# Altium project Seadream-Avionics-V2.PrjPcb
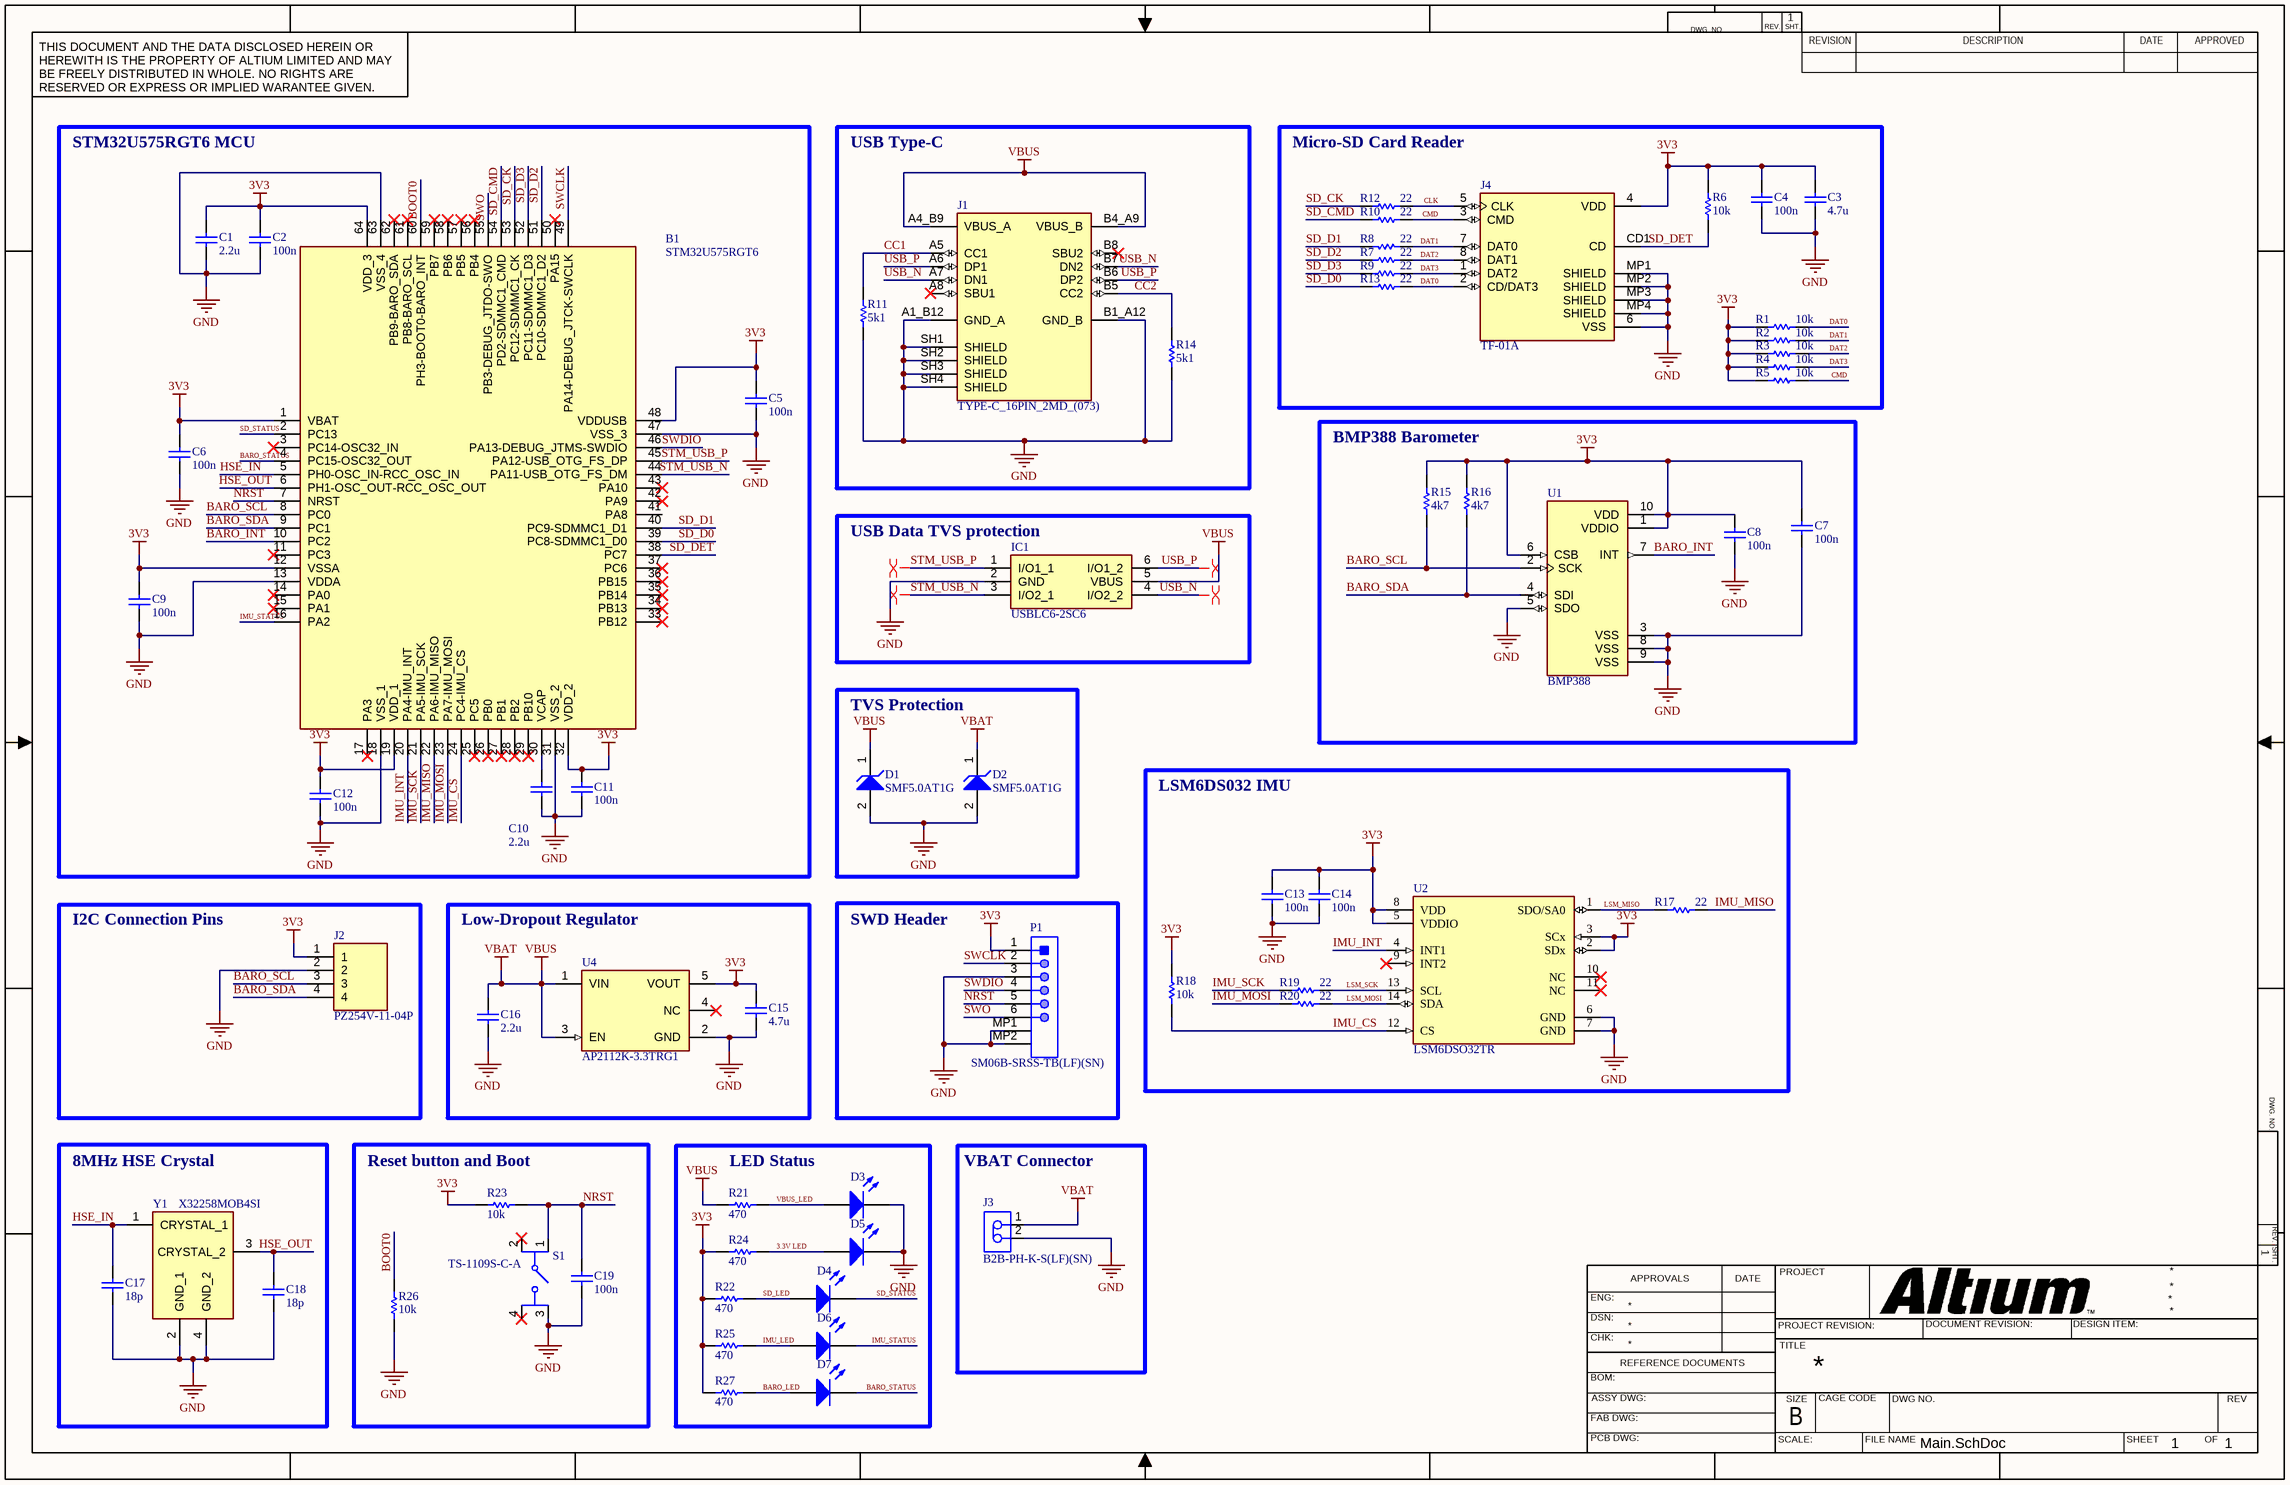
[diagram p0: Main.SchDoc]
1 sheet, 65 parts. Net scope: global (net labels, ports and power ports of the same name join across sheets).
Board file: Seadream_PCB.PcbDoc

## Sheet Main.SchDoc
size 431 x 279 mm; SheetNumber: 1; SheetTotal: 1

### Parts
B1  STM32U575RGT6  [QFP50P1200X1200X160-64N]
C1  value 2.2u  [CAPC1608X90X40LL10T20]  (hidden comment: Capacitor)
C2  value 100n  [CAPC0402(1005)60_L]  (hidden comment: Capacitor)
C3  value 4.7u  [CAPC1608X90X40LL10T20]  (hidden comment: Capacitor)
C4  value 100n  [CAPC0402(1005)60_L]  (hidden comment: Capacitor)
C5  value 100n  [CAPC0402(1005)60_L]  (hidden comment: Capacitor)
C6  value 100n  [CAPC0402(1005)60_L]  (hidden comment: Capacitor)
C7  value 100n  [CAPC0402(1005)60_L]  (hidden comment: Capacitor)
C8  value 100n  [CAPC0402(1005)60_L]  (hidden comment: Capacitor)
C9  value 100n  [CAPC0402(1005)60_L]  (hidden comment: Capacitor)
C10  value 2.2u  [CAPC1608X90X40LL10T20]  (hidden comment: Capacitor)
C11  value 100n  [CAPC0402(1005)60_L]  (hidden comment: Capacitor)
C12  value 100n  [CAPC0402(1005)60_L]  (hidden comment: Capacitor)
C13  value 100n  [CAPC0402(1005)60_L]  (hidden comment: Capacitor)
C14  value 100n  [CAPC0402(1005)60_L]  (hidden comment: Capacitor)
C15  value 4.7u  [CAPC1608X90X40LL10T20]  (hidden comment: Capacitor)
C16  value 2.2u  [CAPC1608X90X40LL10T20]  (hidden comment: Capacitor)
C17  value 18p  [CAPC0402(1005)60_L]  (hidden comment: Capacitor)
C18  value 18p  [CAPC0402(1005)60_L]  (hidden comment: Capacitor)
C19  value 100n  [CAPC0402(1005)60_L]  (hidden comment: Capacitor)
D1  SMF5.0AT1G  [ONSC-SOD-123FL-2-498_V]
D2  SMF5.0AT1G  [ONSC-SOD-123FL-2-498_V]
D3  Light-Emitting Diode  [LTST-C191KRKT_V]  (value not drawn)
D4  Light-Emitting Diode  [LTST-C191KRKT_V]  (value not drawn)
D5  Light-Emitting Diode  [LTST-C191KRKT_V]  (value not drawn)
D6  Light-Emitting Diode  [LTST-C191KRKT_V]  (value not drawn)
D7  Light-Emitting Diode  [LTST-C191KRKT_V]  (value not drawn)
IC1  USBLC6-2SC6  [SOT95P280X145-6N]
J1  TYPE-C_16PIN_2MD_(073)  [SHOUHAN_TYPE-C_16PIN_2MD_(073)]
J2  PZ254V-11-04P  [HDRV4W64P0X254_1X4_1016X250X890P]
J3  B2B-PH-K-S(LF)(SN)  [JST-B2B-PH-K-S_V]
J4  TF-01A  [TF-01A]
P1  SM06B-SRSS-TB(LF)(SN)  [JST-SM06B-SRSS-TB_V]
R1  value 10k  [RESC0402(1005)_L]  (hidden comment: Resistor)
R2  value 10k  [RESC0402(1005)_L]  (hidden comment: Resistor)
R3  value 10k  [RESC0402(1005)_L]  (hidden comment: Resistor)
R4  value 10k  [RESC0402(1005)_L]  (hidden comment: Resistor)
R5  value 10k  [RESC0402(1005)_L]  (hidden comment: Resistor)
R6  value 10k  [RESC0402(1005)_L]  (hidden comment: Resistor)
R7  value 22  [RESC0402(1005)_L]  (hidden comment: Resistor)
R8  value 22  [RESC0402(1005)_L]  (hidden comment: Resistor)
R9  value 22  [RESC0402(1005)_L]  (hidden comment: Resistor)
R10  value 22  [RESC0402(1005)_L]  (hidden comment: Resistor)
R11  value 5k1  [RESC0402(1005)_L]  (hidden comment: Resistor)
R12  value 22  [RESC0402(1005)_L]  (hidden comment: Resistor)
R13  value 22  [RESC0402(1005)_L]  (hidden comment: Resistor)
R14  value 5k1  [RESC0402(1005)_L]  (hidden comment: Resistor)
R15  value 4k7  [RESC0402(1005)_L]  (hidden comment: Resistor)
R16  value 4k7  [RESC0402(1005)_L]  (hidden comment: Resistor)
R17  value 22  [RESC0402(1005)_L]  (hidden comment: Resistor)
R18  value 10k  [RESC0402(1005)_L]  (hidden comment: Resistor)
R19  value 22  [RESC0402(1005)_L]  (hidden comment: Resistor)
R20  value 22  [RESC0402(1005)_L]  (hidden comment: Resistor)
R21  value 470  [RESC1608X55X25LL10T15]  (hidden comment: Resistor)
R22  value 470  [RESC1608X55X25LL10T15]  (hidden comment: Resistor)
R23  value 10k  [RESC0402(1005)_L]  (hidden comment: Resistor)
R24  value 470  [RESC1608X55X25LL10T15]  (hidden comment: Resistor)
R25  value 470  [RESC1608X55X25LL10T15]  (hidden comment: Resistor)
R26  value 10k  [RESC0402(1005)_L]  (hidden comment: Resistor)
R27  value 470  [RESC1608X55X25LL10T15]  (hidden comment: Resistor)
S1  TS-1109S-C-A  [TS1109SCA]
U1  BMP388  [PQFN50P200X200X80-10N]
U2  LSM6DSO32TR  [FP-LGA-14L-DM00249496-MFG]
U4  AP2112K-3.3TRG1  [FP-SOT25-IPC_C]
Y1  X32258MOB4SI  [X32258MOB4SI]

### Blocks framed on the sheet
STM32U575RGT6 MCU: B1 C1 C2 C5 C6 C9-C12
USB Type-C: J1 R11 R14
Micro-SD Card Reader: C3 C4 J4 R1-R10 R12 R13
BMP388 Barometer: C7 C8 R15 R16 U1
USB Data TVS protection: IC1
TVS Protection: D1 D2
LSM6DS032 IMU: C13 C14 R17-R20 U2
I2C Connection Pins: J2
Low-Dropout Regulator: C15 C16 U4
SWD Header: P1
8MHz HSE Crystal: C17 C18 Y1
Reset button and Boot: C19 R23 R26 S1
LED Status: D3-D7 R21 R22 R24 R25 R27
VBAT Connector: J3

### Nets
3V3: B1.1(VBAT) B1.12(VSSA) B1.19(VDD_1) B1.32(VDD_2) B1.48(VDDUSB) B1.64(VDD_3) C1.2 C2.2 C3.2 C4.2 C5.2 C6.2 C7.2 C8.2 C9.2 C11.2 C12.2 C13.2 C14.2 C15.2 J2.1 J4.4(VDD) P1.1 R1.1 R2.1 R3.1 R4.1 R5.1 R6.2 R15.2 R16.2 R18.2 R22.1 R23.2 R24.1 R25.1 R27.1 U1.1(VDDIO) U1.6(CSB) U1.10(VDD) U2.2(SDx) U2.3(SCx) U2.5(VDDIO) U2.8(VDD) U4.5(VOUT)
GND: B1.13(VDDA) B1.18(VSS_1) B1.31(VSS_2) B1.47(VSS_3) B1.63(VSS_4) C1.1 C2.1 C3.1 C4.1 C5.1 C6.1 C7.1 C8.1 C9.1 C10.1 C11.1 C12.1 C13.1 C14.1 C15.1 C16.1 C17.1 C18.1 C19.1 D1.2(A) D2.2(A) D3.2(K) D5.2(K) IC1.2(GND) J1.A1_B12(GND_A) J1.B1_A12(GND_B) J1.SH1(SHIELD) J1.SH2(SHIELD) J1.SH3(SHIELD) J1.SH4(SHIELD) J2.2 J3.2 J4.6(VSS) J4.MP1(SHIELD) J4.MP2(SHIELD) J4.MP3(SHIELD) J4.MP4(SHIELD) P1.3 P1.MP1 P1.MP2 R11.1 R14.1 R26.1 S1.3(NO_1) U1.3(VSS) U1.5(SDO) U1.8(VSS) U1.9(VSS) U2.6(GND) U2.7(GND) U4.2(GND) Y1.2(GND_1) Y1.4(GND_2)
VBAT: C16.2 D1.1(K) D2.1(K) IC1.5(VBUS) J1.A4_B9(VBUS_A) J1.B4_A9(VBUS_B) J3.1 R21.1 U4.1(VIN) U4.3(EN)  [also labelled VBUS]
3.3V LED: D5.1(A) R24.2
BARO_INT: B1.10(PC2) U1.7(INT)
BARO_LED: D7.1(A) R27.2
BARO_SCL: B1.8(PC0) J2.3 R15.1 U1.2(SCK)
BARO_SDA: B1.9(PC1) J2.4 R16.1 U1.4(SDI)
BARO_STATUS: B1.4(PC15-OSC32_OUT) D7.2(K)
BOOT0: B1.60(PH3-BOOT0-BARO_INT) R26.2
CC1: J1.A5(CC1) R11.2
CC2: J1.B5(CC2) R14.2
CLK: J4.5(CLK) R12.1
CMD: J4.3(CMD) R5.2 R10.1
DAT0: J4.2(CD/DAT3) R1.2 R13.1
DAT1: J4.7(DAT0) R2.2 R8.2
DAT2: J4.8(DAT1) R3.2 R7.1
DAT3: J4.1(DAT2) R4.2 R9.1
HSE_IN: B1.5(PH0-OSC_IN-RCC_OSC_IN) C17.2 Y1.1(CRYSTAL_1)
HSE_OUT: B1.6(PH1-OSC_OUT-RCC_OSC_OUT) C18.2 Y1.3(CRYSTAL_2)
IMU_CS: B1.24(PC4-IMU_CS) R18.1 U2.12(CS)
IMU_INT: B1.20(PA4-IMU_INT) U2.4(INT1)
IMU_LED: D6.1(A) R25.2
IMU_MISO: B1.22(PA6-IMU_MISO) R17.1
IMU_MOSI: B1.23(PA7-IMU_MOSI) R20.2
IMU_SCK: B1.21(PA5-IMU_SCK) R19.2
IMU_STATUS: B1.16(PA2) D6.2(K)
LSM_MISO: R17.2 U2.1(SDO/SA0)
LSM_MOSI: R20.1 U2.14(SDA)
LSM_SCK: R19.1 U2.13(SCL)
NRST: B1.7(NRST) C19.2 P1.5 R23.1 S1.1(COM_1)
SD_CK: B1.53(PC12-SDMMC1_CK) R12.2
SD_CMD: B1.54(PD2-SDMMC1_CMD) R10.2
SD_D0: B1.39(PC8-SDMMC1_D0) R13.2
SD_D1: B1.40(PC9-SDMMC1_D1) R8.1
SD_D2: B1.51(PC10-SDMMC1_D2) R7.2
SD_D3: B1.52(PC11-SDMMC1_D3) R9.2
SD_DET: B1.38(PC7) J4.CD1(CD) R6.1
SD_LED: D4.1(A) R22.2
SD_STATUS: B1.2(PC13) D4.2(K)
STM_USB_N: B1.44(PA11-USB_OTG_FS_DM) IC1.3(I/O2_1)
STM_USB_P: B1.45(PA12-USB_OTG_FS_DP) IC1.1(I/O1_1)
SWCLK: B1.49(PA14-DEBUG_JTCK-SWCLK) P1.2
SWDIO: B1.46(PA13-DEBUG_JTMS-SWDIO) P1.4
SWO: B1.55(PB3-DEBUG_JTDO-SWO) P1.6
USB_N: IC1.4(I/O2_2) J1.A7(DN1) J1.B7(DN2)
USB_P: IC1.6(I/O1_2) J1.A6(DP1) J1.B6(DP2)
VBUS_LED: D3.1(A) R21.2
NetB1_30: B1.30(VCAP) C10.2

Not connected (* = marked no-connect by the designer): B1 3(PC14-OSC32_IN)* 11(PC3)* 14(PA0)* 15(PA1)* 17(PA3)* 25(PC5)* 26(PB0)* 27(PB1)* 28(PB2)* 29(PB10)* 33(PB12)* 34(PB13)* 35(PB14)* 36(PB15)* 37(PC6)* 41(PA8) 42(PA9)* 43(PA10)* 50(PA15)* 56(PB4)* 57(PB5)* 58(PB6)* 59(PB7)* 61(PB8-BARO_SCL)* 62(PB9-BARO_SDA)*; J1 A8(SBU1)* B8(SBU2)*; S1 2(COM_2)* 4(NO_2)*; U2 9(INT2)* 10(NC)* 11(NC)*; U4 4(NC)*

### Layout directives
differential pair: STM_USB_N, STM_USB_P, USB_N, USB_P

### Notes on the sheet
- DWG. NO.
- REV.
- SHT.
- THIS DOCUMENT AND THE DATA DISCLOSED HEREIN OR HEREWITH IS THE PROPERTY OF ALTIUM LIMITED AND MAY BE FREELY DISTRIBUTED IN WHOLE. NO RIGHTS ARE RESERVED OR EXPRESS OR IMPLIED WARANTEE GIVEN.
- REVISION
- DESCRIPTION
- DATE
- APPROVED
- ENG:
- APPROVALS
- PROJECT
- DSN:
- CHK:
- REFERENCE DOCUMENTS
- PROJECT REVISION:
- TITLE
- DOCUMENT REVISION:
- DESIGN ITEM:
- BOM:
- FAB DWG:
- PCB DWG:
- ASSY DWG:
- SCALE:
- SIZE
- B
- CAGE CODE
- FILE NAME
- DWG NO.
- SHEET
- OF
- REV

### Library data of the parts
B1 = STM32U575RGT6: Ultra-low-power Arm Cortex-M33 32-bit MCU+TrustZone+FPU, 240 DMIPS, up to 2 MB Flash memory, 786 KB SRAM; Manufacturer_Name: STMicroelectronics; Geometry.Height: 1.6mm; Manufacturer_Part_Number: STM32U575RGT6; Datasheet Link: https://www.st.com/resource/en/datasheet/stm32u575ag.pdf
C1 C10 C16 = Capacitor: 2.2u Capacitor 0603 CL10A225KO8NNNC; SimulationGenericComponent: True
C2 C4-C9 C11-C14 C19 = Capacitor: 100n Capacitor 0402 CL05B104KO5NNNC; SimulationGenericComponent: True
C3 C15 = Capacitor: 4.7u Capacitor 0603 CL10A475KO8NNNC; SimulationGenericComponent: True
C17 C18 = Capacitor: 18p Capacitor 0402 0402CG180J500NT; SimulationGenericComponent: True
D1 D2 = CMP-1061-00612-1: 200 W Transient Voltage Suppressor, 2-Pin SOD-123FL, Pb-Free, Tape and Reel; Manufacturer: On Semiconductor; Direction: Unidirectional; IR Max (uA): 400; V(BR) Typ (V): 6.7; PackageDescription: 2-Pin SOD, Body 1.65 x 2.7 mm; PartNumber: SMF5.0AT1G; ComponentLink3Description: Package Specification; ComponentLink3URL: http://www.onsemi.com/pub_link/Collateral/498-01.PDF; PackageVersion: Rev. D, 05/2013; Mounting Technology: Surface Mount; PackageReference: SOD-123FL-2-498; ComponentLink2URL: http://www.onsemi.com/pub_link/Collateral/SMF5.0AT1-D.PDF; DatasheetVersion: Rev. 7; ComponentLink1Description: Manufacturer URL; Packing: Tape and Reel; RoHS: Pb-Free; ComponentLink1URL: http://www.onsemi.com/; ComponentLink2Description: Datasheet
D3-D7 = LED: Red Light-Emitting Diode 0603 KT-0603R; AF: 1; BV: 0; BV_MAX: 1e99; EG: 1.11; FC: 0.5; IBV: 0.001; IS: 1e-14; MJSW: 0.33; NTUN: 30; TNOM: 27; XTI: 3; SimulationGenericComponent: True; CJO: 0; CJP: 0; CTA: 0; CTP: 0; FCS: 0.5; FV_MAX: 1e99; IKF: 0; IKR: 0; ISR: 1e-14; JSW: 0; JTUN: 0; JTUNSW: 0; KEG: 1; KF: 0; LEVEL: 1; N: 1; NBV: 1; NR: 1; NS: 1; PHP: 1; RS: 0; TCV: 0; TLEV: 0; TLEVC: 0; TM1: 0; TM2: 0; TPB: 0; TPHP: 0; TRS: 0; TRS2: 0; TT: 0; TTT1: 0; TTT2: 0; VJ: 1; XTITUN: 3
IC1 = USBLC6-2SC6: Integrated Circuit; Manufacturer_Name: STMicroelectronics; Datasheet Link: https://www.st.com/resource/en/datasheet/usblc6-2.pdf; Height: 1.45mm; Manufacturer_Part_Number: USBLC6-2SC6; Mouser Part Number: 511-USBLC6-2SC6; Mouser Price/Stock: https://www.mouser.co.uk/ProductDetail/STMicroelectronics/USBLC6-2SC6?qs=po45yt2pPpu%2FhNIlwQdTlg%3D%3D; Arrow Part Number: USBLC6-2SC6; Arrow Price/Stock: https://www.arrow.com/en/products/usblc6-2sc6/stmicroelectronics?utm_currency=USD&region=europe
J1 = CMP-025-000000-1: DC-5V 5A Type C USB; MP: TYPE-C 16PIN 2MD (073); MF: Shouhan; Source: TYPE-C_16PIN_2MD_(073).SchLib; Component Type: Standard; Check_prices: https://www.snapeda.com/parts/TYPE-C%2016PIN%202MD%20(073)/Shouhan/view-part/?ref=eda; Design Item ID: TYPE-C_16PIN_2MD_(073); Value: *; SnapEDA_Link: https://www.snapeda.com/parts/TYPE-C%2016PIN%202MD%20(073)/Shouhan/view-part/?ref=snap; Pin Count: 16; Package: Package
J2 = PZ254V-11-04P: Connector; Manufacturer_Name: XFCN; Datasheet Link: https://datasheet.lcsc.com/lcsc/2003141432_XFCN-PZ254V-11-04P_C492403.pdf; Height: 8.9mm; Manufacturer_Part_Number: PZ254V-11-04P
J3 = CMP-2000-05162-1: Male Header, Pitch 2 mm, 1 x 2 Position, Height 6 mm, Tail Length 3.4 mm, -25 to 85 degC, RoHS, Bulk; Manufacturer: JST; Pitch: 2mm; Style/Orientation: StraightHeader/Plug; No of Positions: 2; Datasheet Version: Nov-08; Datasheet URL: http://datasheet.octopart.com/B2B-PH-K-S%28LF%29%28SN%29-JST-datasheet-8324864.pdf; Manufacturer URL: http://www.jst.com/home2.html; Type: ShroudedHeader; Termination: Crimp
J4 = CMP-029-000000-4: Standard Card Edge Connectors; MF: HRO Electronics Co., Ltd.; Pin Count: 13; Price: None; Check_prices: https://www.snapeda.com/parts/TF-01A/HRO+Electronics+Co.%252C+Ltd./view-part/?ref=eda; Component Type: Standard; MP: TF-01A; Value: *; Design Item ID: TF-01A; Availability: Not in stock; Source: TF-01A.SchLib; Package: Package; SnapEDA_Link: https://www.snapeda.com/parts/TF-01A/HRO+Electronics+Co.%252C+Ltd./view-part/?ref=snap
P1 = CMP-2000-07080-1: Male Header, Pitch 1 mm, 1 x 6 Position, Height 2.95 mm, -25 to 85 degC, RoHS, Tape and Reel; Manufacturer: JST; No of Positions: 6; Pitch: 1mm; Style/Orientation: RightAngleHeader/Plug; Datasheet URL: https://datasheet.ciiva.com/26894/getdatasheetpartid-708885-26894671.pdf; Package Description: Male Header, Pitch 1 mm, 1 X 6 Position, Height 2.9 mm; Termination: Solder; Manufacturer URL: http://www.jst.com/home2.html; Type: ShroudedHeader; Package Reference: SM06B-SRSS-TB; Datasheet Version: 11/2010; Mounting Technology: SurfaceMount
R1-R6 R18 R23 R26 = Resistor: 10k Resistor 0402 0402WGF1002TCE; TC1: 0; SimulationGenericComponent: True; TC2: 0
R7-R10 R12 R13 R17 R19 R20 = Resistor: 22 Resistor 0402 0402WGF220JTCE; TC1: 0; SimulationGenericComponent: True; TC2: 0
R11 R14 = Resistor: 5k1 Resistor 0402 0402WGF5101TCE; TC1: 0; SimulationGenericComponent: True; TC2: 0
R15 R16 = Resistor: 4k7 Resistor 0402 0402WGF4701TCE; TC1: 0; SimulationGenericComponent: True; TC2: 0
R21 R22 R24 R25 R27 = Resistor: 470 Resistor 0603 0603WAF4700T5E; TC1: 0; SimulationGenericComponent: True; TC2: 0
S1 = TS-1109S-C-A: Switch (4-Pin Push); Manufacturer_Name: XKB Connectivity; Datasheet Link: http://www.helloxkb.com/public/images/pdf/TS-1109S-X-X.pdf; Height: 4.5mm; Manufacturer_Part_Number: TS-1109S-C-A
U1 = CMP-031-00007-2: P-Sensor SPI I2C 1, 25 Bar SMD; Design Item ID: BMP388; MP: BMP388; Pins: 10; Availability: Unavailable; Value: *; Source: BMP388.SchLib; Price: None; Component Type: Standard; Case/Package: None
U2 = CMP-12177-000015-1: INEMO INERTIAL MODULE: 3D ACCELE
U4 = CMP-12756-000035-1: IC REG LINEAR 3.3V 600MA SOT25; Number of Regulators: 1; Output Type: Fixed; Polarity: Positive; Min Input Voltage: 2.5V; Max Input Voltage: 6V; Accuracy: 1.5%; Quiescent Current: 55uA; Dropout Voltage: 250mV; Min Operating Temperature: -40°C; Length: 3.1mm; Output Current: 600mA; Max Operating Temperature: 85°C; Package Quantity: 1; Output Voltage: 3.3V; Width: 1.7mm; Number of Outputs: 1; Packaging: Tape and Reel; Height: 1.3mm; Lead Free: Lead Free; Max Output Current: 600mA; Case/Package: SOT-23-5; Mount: Surface Mount; Number of Pins: 5
Y1 = X32258MOB4SI: Crystal or Oscillator; Manufacturer_Name: YXC; Datasheet Link: https://item.szlcsc.com/datasheet/X32258MOB4SI/2777872.html; Height: 0.8mm; Manufacturer_Part_Number: X32258MOB4SI